# EAGLE design bt for oil (EAGLE 6.1)
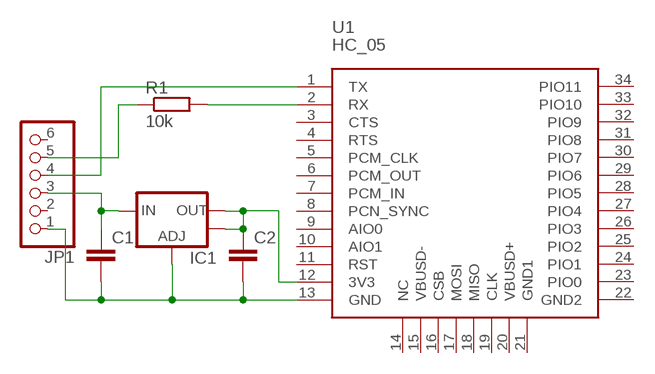
[diagram p0: schematic, sheet 1]

## Parts
C1  C-EUC0805  [C0805]
C2  C-EUC0805  [C0805]
IC1  V_REG_LM1117SOT223  [SOT223]
JP1  PINHD-1X6/90  [1X06/90]
R1  10k  R-EU_M0805  [M0805]
U1  HC_05  [BLUETOOTH_SMD]

## Nets
3V3: C2.1 IC1.2(OUT) IC1.4(OUT) U1.12(3V3)
5V: C1.1 IC1.3(IN) JP1.3
GND: C1.2 C2.2 IC1.1(ADJ) JP1.1 U1.13(GND)
N$1: R1.2 U1.2(RX)
RX: JP1.5 R1.1
TX: JP1.4 U1.1(TX)
Unconnected: JP1.2 JP1.6 U1.3(CTS) U1.4(RTS) U1.5(PCM_CLK) U1.6(PCM_OUT) U1.7(PCM_IN) U1.8(PCN_SYNC) U1.9(AIO0) U1.10(AIO1) U1.11(RST) U1.14(NC) U1.15(VBUSD-) U1.16(CSB) U1.17(MOSI) U1.18(MISO) U1.19(CLK) U1.20(VBUSD+) U1.21(GND1) U1.22(GND2) U1.23(PIO0) U1.24(PIO1) U1.25(PIO2) U1.26(PIO3) U1.27(PIO4) U1.28(PIO5) U1.29(PIO6) U1.30(PIO7) U1.31(PIO8) U1.32(PIO9) U1.33(PIO10) U1.34(PIO11)

## Library data of the parts
C1 C2 = rcl:C-EU: CAPACITOR, European symbol
IC1 = SparkFun-PowerIC:V_REG_LM1117: Voltage Regulator LM1117 Standard adjustable voltage regulator but in SMD form. Spark Fun Electronics SKU : COM-00595
JP1 = pinhead:PINHD-1X6: PIN HEADER
R1 = rcl:R-EU_: RESISTOR, European symbol
U1 = SerialPortBluetooth:HC_05

## Board
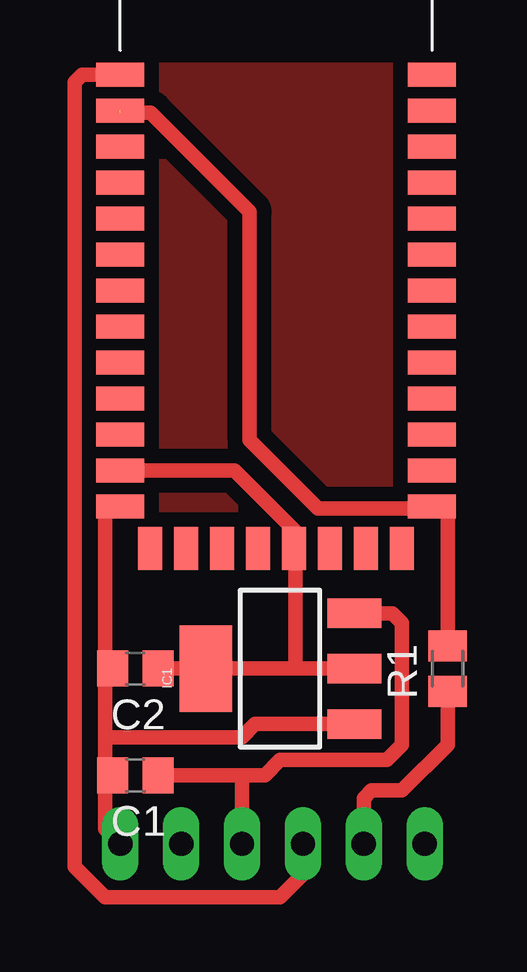
[diagram p1: board, top side]
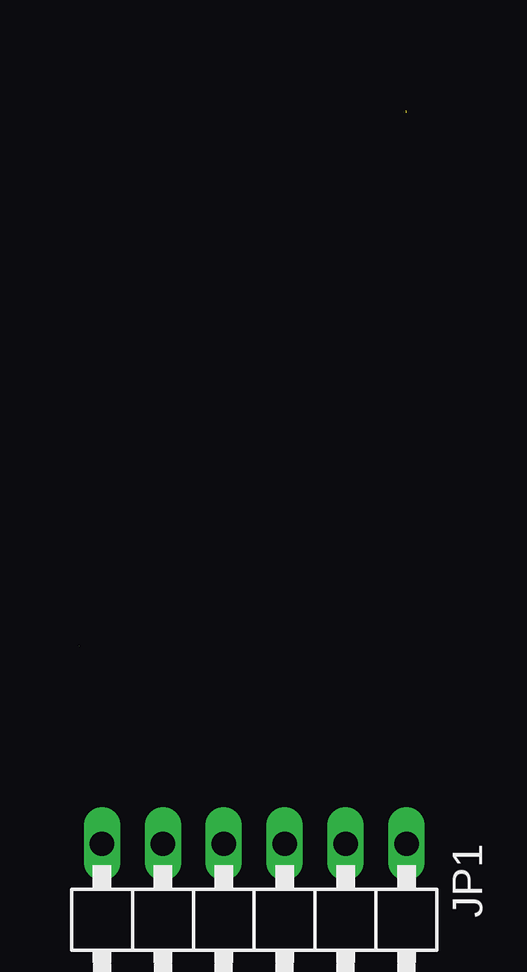
[diagram p2: board, bottom side, seen from below]

No outline drawn. Coordinates in mm, seen from the top.
Copper layers (1*16): Top 0.035mm / dielectric 1.5mm / Bottom 0.035mm
Design rules: minimum track width 10mil, minimum drill 24mil, track to track 8mil, track to pad 8mil, pad to pad 8mil, via to via 8mil, smd to smd 8mil, copper to edge 40mil, drill to drill 8mil, minimum pad ring 10mil, minimum via ring 8mil, stop-mask expansion 4mil, vias tented up to drill 0mil, thermal gap 10mil

### Footprints (pad centres in the part's own frame; a part is rotated, then mirrored left to right if it is on the bottom)
C0805 = smd 1.3 x 1.5: 1 -0.95,0; 2 0.95,0
SOT223 = smd 1.219 x 2.235: 1 -2.311,-3.099; 2 0,-3.099; 3 2.311,-3.099 | smd 3.6 x 2.2: 4 0,3.099
1X06/90 = drill 1.016 long: 1 -6.35,-3.81; 2 -3.81,-3.81; 3 -1.27,-3.81; 4 1.27,-3.81; 5 3.81,-3.81; 6 6.35,-3.81
M0805 = smd 1.3 x 1.6: 1 -0.95,0; 2 0.95,0
BLUETOOTH_SMD = smd 2 x 1: 1 0,0; 2 0,-1.5; 3 0,-3; 4 0,-4.5; 5 0,-6; 6 0,-7.5; 7 0,-9; 8 0,-10.5; 9 0,-12; 10 0,-13.5; 11 0,-15; 12 0,-16.5; 13 0,-18; 22 13,-18; 23 13,-16.5; 24 13,-15; 25 13,-13.5; 26 13,-12; 27 13,-10.5; 28 13,-9; 29 13,-7.5; 30 13,-6; 31 13,-4.5; 32 13,-3; 33 13,-1.5; 34 13,0 | smd 1 x 1.8: 14 1.25,-19.75; 15 2.75,-19.75; 16 4.25,-19.75; 17 5.75,-19.75; 18 7.25,-19.75; 19 8.75,-19.75; 20 10.25,-19.75; 21 11.75,-19.75

### Placement (x,y rotation side)
C1  5.4,8.26 180 top
C2  5.4,12.7 180 top
IC1  11.43,12.7 90 top
JP1  11.11,1.59 180 bottom
R1  18.41,12.7 90 top
U1  4.76,37.47 0 top

### Tracks (layer width: path | path; a pad name or v marks a point on that pad's centre or on a via)
3V3
  Top 0.61: 12.06,12.7 IC1.4 C2.1 | 12.06,12.7 IC1.2 | U1.12 4.77,20.95 9.53,20.95 12.06,18.41 12.06,12.7
5V
  Top 0.61: IC1.3 16.1,15.01 16.51,14.61 16.51,9.53 15.88,8.89 11.43,8.89 10.79,8.26 9.84,8.26 | 9.84,8.26 C1.1 | 9.84,8.26 JP1.3
GND
  Top 0.61: U1.13 4.54,19.46 4.13,19.37 4.13,12.7 | 4.13,12.7 4.13,9.84 | 4.45,9.85 4.13,9.84 | IC1.1 10.39,10.39 9.84,9.84 4.13,9.84 | 4.13,12.7 C2.2 | 4.13,9.84 4.13,8.26 | 4.13,8.26 4.13,6.03 JP1.1 | C1.2 4.13,8.26
N$1  (2 unrouted)
  Top 0.61: R1.2 18.41,19.37 13.02,19.37 10.16,22.23 10.16,31.75 6.03,35.88 4.76,35.88
N$2
  pour Top (isolate 0.61): 4.76,37.78 17.78,37.78 17.78,17.78 4.76,17.78
RX
  Top 0.61: R1.1 18.41,9.53 16.51,7.62 15.24,7.62 14.92,7.3 JP1.5
TX
  Top 0.61: U1.1 3.17,37.47 2.86,37.15 2.86,4.45 4.13,3.17 11.43,3.17 12.38,4.13 JP1.4